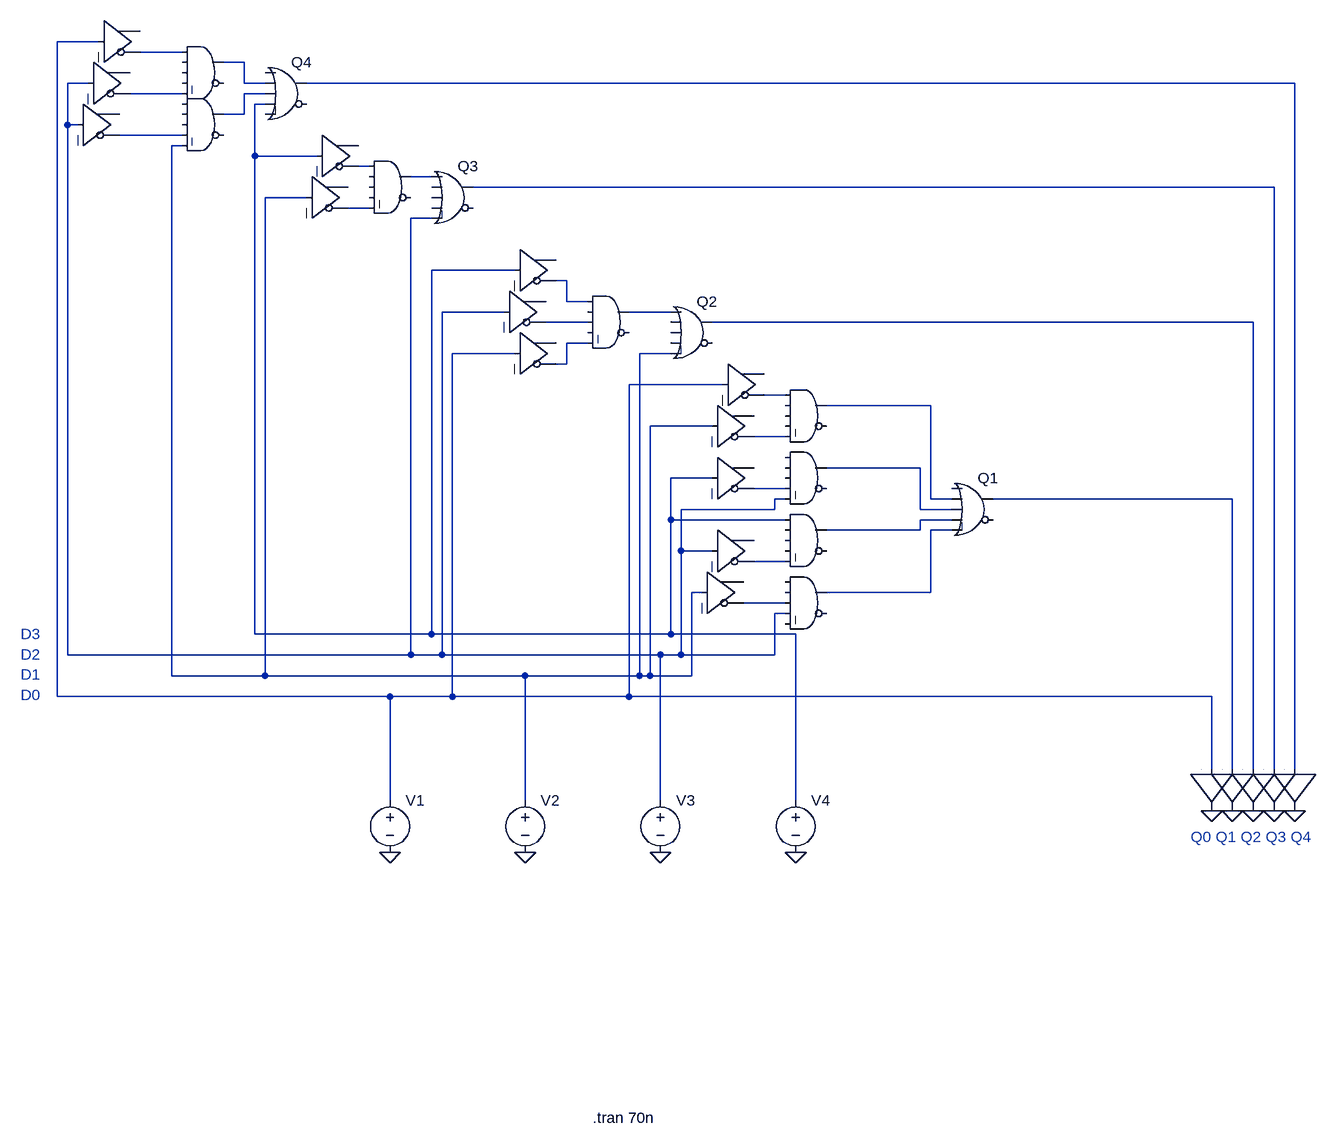
[diagram p0: schematic idealne.asc]
idealne.asc, the LTspice schematic file:
Version 4
SHEET 1 3760 824
WIRE -304 -1152 -368 -1152
WIRE -176 -1136 -240 -1136
WIRE -80 -1120 -112 -1120
WIRE -320 -1088 -352 -1088
WIRE -80 -1088 -80 -1120
WIRE -48 -1088 -80 -1088
WIRE 1536 -1088 16 -1088
WIRE -176 -1072 -256 -1072
WIRE -48 -1072 -80 -1072
WIRE -48 -1056 -64 -1056
WIRE -80 -1040 -80 -1072
WIRE -80 -1040 -112 -1040
WIRE -352 -1024 -352 -1088
WIRE -336 -1024 -352 -1024
WIRE -176 -1008 -272 -1008
WIRE -176 -992 -192 -992
WIRE -64 -976 -64 -1056
WIRE 32 -976 -64 -976
WIRE 112 -960 96 -960
WIRE 208 -944 176 -944
WIRE 1504 -928 272 -928
WIRE 16 -912 -48 -912
WIRE 112 -896 80 -896
WIRE 208 -880 176 -880
WIRE 336 -800 208 -800
WIRE 416 -784 400 -784
WIRE 416 -752 416 -784
WIRE 448 -752 416 -752
WIRE 320 -736 224 -736
WIRE 576 -736 512 -736
WIRE 448 -720 384 -720
WIRE 1472 -720 640 -720
WIRE 448 -688 416 -688
WIRE 336 -672 240 -672
WIRE 576 -672 528 -672
WIRE 416 -656 416 -688
WIRE 416 -656 400 -656
WIRE 656 -624 512 -624
WIRE 752 -608 720 -608
WIRE 976 -592 816 -592
WIRE 640 -560 544 -560
WIRE 752 -544 704 -544
WIRE 960 -496 816 -496
WIRE 640 -480 576 -480
WIRE 752 -464 704 -464
WIRE 752 -448 736 -448
WIRE 976 -448 976 -592
WIRE 1008 -448 976 -448
WIRE 1440 -448 1072 -448
WIRE 736 -432 736 -448
WIRE 736 -432 592 -432
WIRE 960 -432 960 -496
WIRE 1008 -432 960 -432
WIRE 576 -416 576 -480
WIRE 752 -416 576 -416
WIRE 1008 -416 960 -416
WIRE 960 -400 960 -416
WIRE 960 -400 816 -400
WIRE 1008 -400 976 -400
WIRE 592 -368 592 -432
WIRE 640 -368 592 -368
WIRE 752 -352 704 -352
WIRE 624 -304 608 -304
WIRE 976 -304 976 -400
WIRE 976 -304 816 -304
WIRE 752 -288 688 -288
WIRE 752 -272 736 -272
WIRE -64 -240 -64 -976
WIRE 208 -240 208 -800
WIRE 208 -240 -64 -240
WIRE 576 -240 576 -416
WIRE 576 -240 208 -240
WIRE 768 -240 576 -240
WIRE -352 -208 -352 -1024
WIRE 176 -208 176 -880
WIRE 176 -208 -352 -208
WIRE 224 -208 224 -736
WIRE 224 -208 176 -208
WIRE 560 -208 224 -208
WIRE 592 -208 592 -368
WIRE 592 -208 560 -208
WIRE 736 -208 736 -272
WIRE 736 -208 592 -208
WIRE -192 -176 -192 -992
WIRE -48 -176 -48 -912
WIRE -48 -176 -192 -176
WIRE 352 -176 -48 -176
WIRE 528 -176 528 -672
WIRE 528 -176 352 -176
WIRE 544 -176 544 -560
WIRE 544 -176 528 -176
WIRE 608 -176 608 -304
WIRE 608 -176 544 -176
WIRE -368 -144 -368 -1152
WIRE 144 -144 -368 -144
WIRE 240 -144 240 -672
WIRE 240 -144 144 -144
WIRE 512 -144 512 -624
WIRE 512 -144 240 -144
WIRE 1408 -144 512 -144
WIRE 1408 -32 1408 -144
WIRE 1440 -32 1440 -448
WIRE 1472 -32 1472 -720
WIRE 1504 -32 1504 -928
WIRE 1536 -32 1536 -1088
WIRE 144 16 144 -144
WIRE 352 16 352 -176
WIRE 560 16 560 -208
WIRE 768 16 768 -240
FLAG 144 96 0
FLAG 352 96 0
FLAG 560 96 0
FLAG 768 96 0
FLAG 1408 32 0
FLAG 1440 32 0
FLAG 1472 32 0
FLAG 1504 32 0
FLAG 1536 32 0
SYMBOL Digital\\and -144 -1168 R0
WINDOW 0 16 24 Invisible 2
SYMATTR InstName A1
SYMBOL Digital\\and -144 -1088 R0
WINDOW 0 16 24 Invisible 2
SYMATTR InstName A2
SYMBOL Digital\\or -16 -1136 R0
SYMATTR InstName Q4
SYMBOL Digital\\buf -304 -1216 R0
WINDOW 0 8 16 Invisible 2
SYMATTR InstName A4
SYMBOL Digital\\buf -320 -1152 R0
WINDOW 0 8 16 Invisible 2
SYMATTR InstName A5
SYMBOL Digital\\buf -336 -1088 R0
WINDOW 0 8 16 Invisible 2
SYMATTR InstName A6
SYMBOL Digital\\and 144 -992 R0
WINDOW 0 16 24 Invisible 2
SYMATTR InstName A7
SYMBOL Digital\\or 240 -976 R0
SYMATTR InstName Q3
SYMBOL Digital\\buf 32 -1040 R0
WINDOW 0 8 16 Invisible 2
SYMATTR InstName A9
SYMBOL Digital\\buf 16 -976 R0
WINDOW 0 8 16 Invisible 2
SYMATTR InstName A10
SYMBOL Digital\\and 480 -784 R0
WINDOW 0 16 24 Invisible 2
SYMATTR InstName A3
SYMBOL Digital\\or 608 -768 R0
SYMATTR InstName Q2
SYMBOL Digital\\buf 336 -864 R0
WINDOW 0 8 16 Invisible 2
SYMATTR InstName A11
SYMBOL Digital\\buf 320 -800 R0
WINDOW 0 8 16 Invisible 2
SYMATTR InstName A12
SYMBOL Digital\\buf 336 -736 R0
WINDOW 0 8 16 Invisible 2
SYMATTR InstName A13
SYMBOL Digital\\or 1040 -496 R0
SYMATTR InstName Q1
SYMBOL voltage 144 0 R0
WINDOW 123 0 0 Left 0
WINDOW 39 0 0 Left 0
WINDOW 3 24 44 Invisible 2
SYMATTR Value PWL file=s1.txt
SYMATTR InstName V1
SYMBOL voltage 352 0 R0
WINDOW 123 0 0 Left 0
WINDOW 39 0 0 Left 0
WINDOW 3 24 96 Invisible 2
SYMATTR Value PWL file=s2.txt
SYMATTR InstName V2
SYMBOL voltage 560 0 R0
WINDOW 123 0 0 Left 0
WINDOW 39 0 0 Left 0
WINDOW 3 24 96 Invisible 2
SYMATTR Value PWL file=s3.txt
SYMATTR InstName V3
SYMBOL voltage 768 0 R0
WINDOW 123 0 0 Left 0
WINDOW 39 0 0 Left 0
WINDOW 3 24 96 Invisible 2
SYMATTR Value PWL file=s4.txt
SYMATTR InstName V4
SYMBOL Digital\\and 784 -640 R0
WINDOW 0 16 24 Invisible 2
SYMATTR InstName A8
SYMBOL Digital\\and 784 -544 R0
WINDOW 0 16 24 Invisible 2
SYMATTR InstName A14
SYMBOL Digital\\and 784 -448 R0
WINDOW 0 16 24 Invisible 2
SYMATTR InstName A15
SYMBOL Digital\\and 784 -352 R0
WINDOW 0 16 24 Invisible 2
SYMATTR InstName A16
SYMBOL Digital\\buf 656 -688 R0
WINDOW 0 8 16 Invisible 2
SYMATTR InstName A17
SYMBOL Digital\\buf 640 -624 R0
WINDOW 0 8 16 Invisible 2
SYMATTR InstName A18
SYMBOL Digital\\buf 640 -544 R0
WINDOW 0 8 16 Invisible 2
SYMATTR InstName A19
SYMBOL Digital\\buf 640 -432 R0
WINDOW 0 8 16 Invisible 2
SYMATTR InstName A20
SYMBOL Digital\\buf 624 -368 R0
WINDOW 0 8 16 Invisible 2
SYMATTR InstName A21
SYMBOL Digital\\buf1 1472 -32 R90
WINDOW 0 8 32 Invisible 2
SYMATTR InstName A22
SYMBOL Digital\\buf1 1504 -32 R90
WINDOW 0 8 32 Invisible 2
SYMATTR InstName A23
SYMBOL Digital\\buf1 1536 -32 R90
WINDOW 0 8 32 Invisible 2
SYMATTR InstName A24
SYMBOL Digital\\buf1 1568 -32 R90
WINDOW 0 8 32 Invisible 2
SYMATTR InstName A25
SYMBOL Digital\\buf1 1600 -32 R90
WINDOW 0 8 32 Invisible 2
SYMATTR InstName A26
TEXT -424 -240 Left 2 ;D3\nD2\nD1\nD0
TEXT 456 504 Left 2 !.tran 70n
TEXT 1376 72 Left 2 ;Q0 Q1 Q2 Q3 Q4

The netlist it stands for:
* idealne.asc
A1 N002 0 0 0 N006 0 N003 0 AND
A2 0 0 0 N009 N010 0 N007 0 AND
A§Q4 0 N003 N007 N008 0 0 N005 0 OR
A4 N001 0 0 0 0 N002 0 0 BUF
A5 N004 0 0 0 0 N006 0 0 BUF
A6 N004 0 0 0 0 N009 0 0 BUF
A7 N011 0 0 0 N014 0 N012 0 AND
A§Q3 N012 0 0 0 N004 0 N013 0 OR
A9 N008 0 0 0 0 N011 0 0 BUF
A10 N010 0 0 0 0 N014 0 0 BUF
A3 N015 0 N017 0 N019 0 N016 0 AND
A§Q2 N016 0 0 0 N010 0 N018 0 OR
A11 N008 0 0 0 0 N015 0 0 BUF
A12 N004 0 0 0 0 N017 0 0 BUF
A13 N001 0 0 0 0 N019 0 0 BUF
A§Q1 0 N021 N023 N026 N027 0 N025 0 OR
V1 N001 0 PWL file=s1.txt
V2 N010 0 PWL file=s2.txt
V3 N004 0 PWL file=s3.txt
V4 N008 0 PWL file=s4.txt
A8 N020 0 0 0 N022 0 N021 0 AND
A14 0 0 0 N024 N004 0 N023 0 AND
A15 N008 0 0 0 N028 0 N026 0 AND
A16 0 0 N029 N004 0 0 N027 0 AND
A17 N001 0 0 0 0 N020 0 0 BUF
A18 N010 0 0 0 0 N022 0 0 BUF
A19 N008 0 0 0 0 N024 0 0 BUF
A20 N004 0 0 0 0 N028 0 0 BUF
A21 N010 0 0 0 0 N029 0 0 BUF
A22 N001 0 0 0 0 0 0 0 BUF
A23 N025 0 0 0 0 0 0 0 BUF
A24 N018 0 0 0 0 0 0 0 BUF
A25 N013 0 0 0 0 0 0 0 BUF
A26 N005 0 0 0 0 0 0 0 BUF
* D3
* D2
* D1
* D0
.tran 70n
* Q0 Q1 Q2 Q3 Q4
.backanno
.end